# Altium project Motor_control.PrjPcb
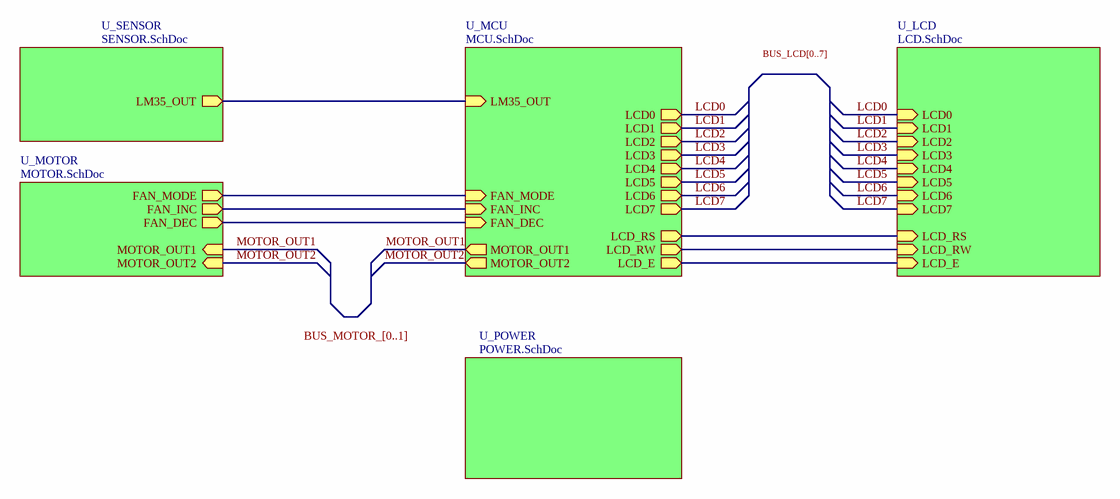
[diagram p0: MAIN.SchDoc]
6 sheets, 38 parts. Net scope: hierarchical (ports join the sheet entries above them; power ports are global).
Board file: PCB_Motor_controller.PcbDoc
Sheets:
  MAIN.SchDoc
    U_MCU = MCU.SchDoc
    U_LCD = LCD.SchDoc
    U_MOTOR = MOTOR.SchDoc
    U_POWER = POWER.SchDoc
    U_SENSOR = SENSOR.SchDoc

## Sheet MAIN.SchDoc
size A4; Author: Khoi Nghiem; Organization: Bach Khoa HN; Address1: Bach Khoa- HBT - HN; Address2: khoi.nt192941; Revision: 1.0Ver; SheetNumber: 1; SheetTotal: 6

### Sub-sheets
U_LCD = LCD.SchDoc: LCD0 (in), LCD1 (in), LCD2 (in), LCD3 (in), LCD4 (in), LCD5 (in), LCD6 (in), LCD7 (in), LCD_RS (in), LCD_RW (in), LCD_E (in)
U_MCU = MCU.SchDoc: LM35_OUT (in), MOTOR_OUT1 (out), MOTOR_OUT2 (out), FAN_MODE (in), FAN_INC (in), FAN_DEC (in), LCD0 (out), LCD1 (out), LCD2 (out), LCD3 (out), LCD4 (out), LCD5 (out), LCD6 (out), LCD7 (out), LCD_RS (out), LCD_RW (out), LCD_E (out)
U_MOTOR = MOTOR.SchDoc: MOTOR_OUT1 (in), MOTOR_OUT2 (in), FAN_MODE (out), FAN_INC (out), FAN_DEC (out)
U_POWER = POWER.SchDoc: no entries
U_SENSOR = SENSOR.SchDoc: LM35_OUT (out)

### Nets
FAN_DEC: sheet U_MCU/FAN_DEC, sheet U_MOTOR/FAN_DEC
FAN_INC: sheet U_MCU/FAN_INC, sheet U_MOTOR/FAN_INC
FAN_MODE: sheet U_MCU/FAN_MODE, sheet U_MOTOR/FAN_MODE
LCD0: sheet U_MCU/LCD0, sheet U_LCD/LCD0
LCD1: sheet U_MCU/LCD1, sheet U_LCD/LCD1
LCD2: sheet U_MCU/LCD2, sheet U_LCD/LCD2
LCD3: sheet U_MCU/LCD3, sheet U_LCD/LCD3
LCD4: sheet U_MCU/LCD4, sheet U_LCD/LCD4
LCD5: sheet U_MCU/LCD5, sheet U_LCD/LCD5
LCD6: sheet U_MCU/LCD6, sheet U_LCD/LCD6
LCD7: sheet U_MCU/LCD7, sheet U_LCD/LCD7
LCD_E: sheet U_MCU/LCD_E, sheet U_LCD/LCD_E
LCD_RS: sheet U_MCU/LCD_RS, sheet U_LCD/LCD_RS
LCD_RW: sheet U_MCU/LCD_RW, sheet U_LCD/LCD_RW
LM35_OUT: sheet U_MCU/LM35_OUT, sheet U_SENSOR/LM35_OUT
MOTOR_OUT1: sheet U_MCU/MOTOR_OUT1, sheet U_MOTOR/MOTOR_OUT1
MOTOR_OUT2: sheet U_MCU/MOTOR_OUT2, sheet U_MOTOR/MOTOR_OUT2

### Notes on the sheet
- BUS_LCD[0..7]
- BUS_MOTOR_[0..1]
- Title
- Size:
- Date:
- Author:
- A4
- Time:
- Number:
- Checked:
- Revision:
- Sheet
- Approved:
- of
- File:

## Sheet MCU.SchDoc
size A4; Author: Khanh BK; Organization: DB Bach Khoa HN; Address1: Bach Khoa- HBT - HN; Address2: khanh.db192932; Address3: Youtube: Đào Bá Khánh; Address4: 0357698570; Revision: 1.0Ver; SheetNumber: 2; SheetTotal: 6
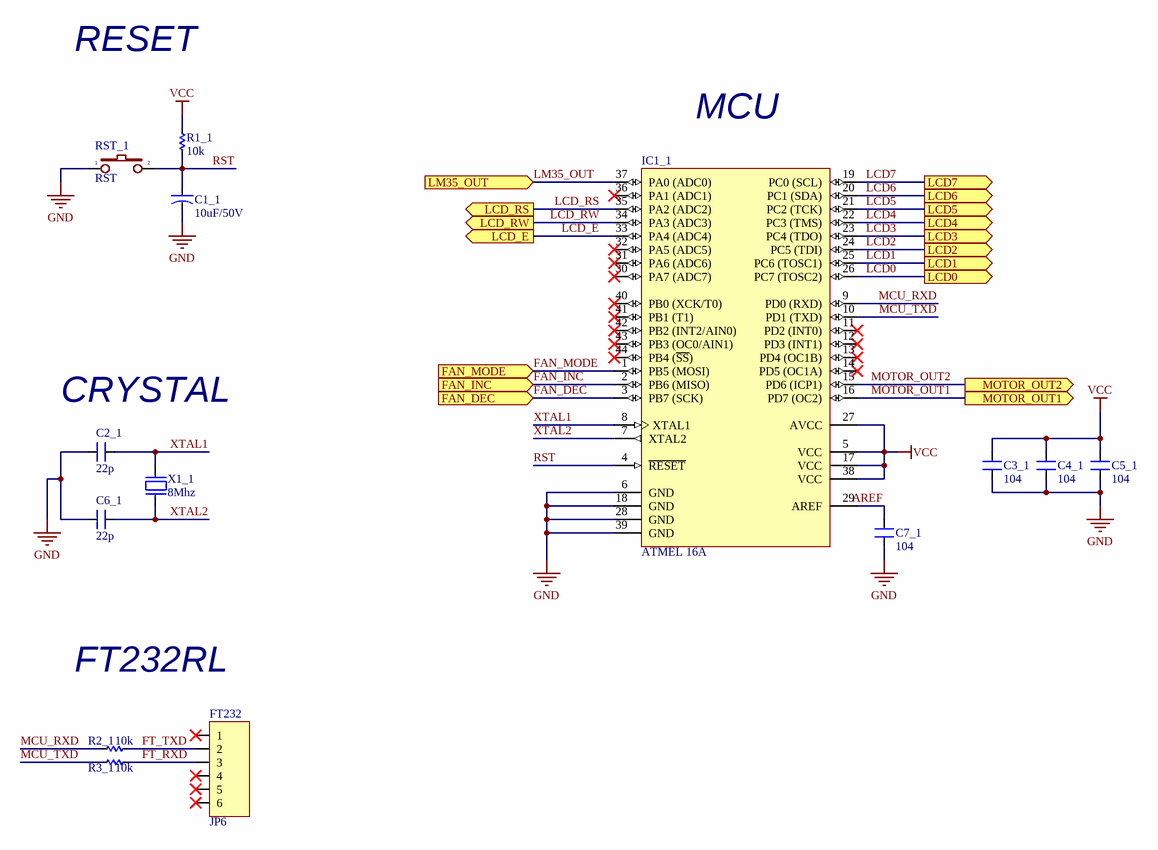
[diagram p1: MCU.SchDoc]

### Parts
C1_1  10uF/50V  [CAP-ALU-SMD-5.5x5.5]
C2_1  22p  [CN-SMD-0805]
C3_1  104  [CN-SMD-0805]
C4_1  104  [CN-SMD-0805]
C5_1  104  [CN-SMD-0805]
C6_1  22p  [CN-SMD-0805]
C7_1  104  [CN-SMD-0805]
FT232  JP6  [JP6-C1T]
IC1_1  ATMEL 16A  [TQFP44]
R1_1  10k  [RES-SMD-0805]
R2_1  10k  [RES-SMD-0805]
R3_1  10k  [RES-SMD-0805]
RST_1  RST  [SW1-SMD]
X1_1  8Mhz  [XT2]

### Ports
FAN_DEC (in), FAN_INC (in), FAN_MODE (in), LCD0 (out), LCD1 (out), LCD2 (out), LCD3 (out), LCD4 (out), LCD5 (out), LCD6 (out), LCD7 (out), LCD_E (out), LCD_RS (out), LCD_RW (out), LM35_OUT (in), MOTOR_OUT1 (out), MOTOR_OUT2 (out)

### Nets
GND: C1_1.2 C2_1.2 C3_1.1 C4_1.1 C5_1.1 C6_1.2 C7_1.1 IC1_1.6(GND) IC1_1.18(GND) IC1_1.28(GND) IC1_1.39(GND) RST_1.1
VCC: C3_1.2 C4_1.2 C5_1.2 IC1_1.5(VCC) IC1_1.17(VCC) IC1_1.27(AVCC) IC1_1.38(VCC) R1_1.1
AREF: C7_1.2 IC1_1.29(AREF)
FAN_DEC: IC1_1.3(PB7_(SCK)) ; port FAN_DEC
FAN_INC: IC1_1.2(PB6_(MISO)) ; port FAN_INC
FAN_MODE: IC1_1.1(PB5_(MOSI)) ; port FAN_MODE
FT_RXD: FT232.3 R3_1.1
FT_TXD: FT232.2 R2_1.1
LCD0: IC1_1.26(PC7_(TOSC2)) ; port LCD0
LCD1: IC1_1.25(PC6_(TOSC1)) ; port LCD1
LCD2: IC1_1.24(PC5_(TDI)) ; port LCD2
LCD3: IC1_1.23(PC4_(TDO)) ; port LCD3
LCD4: IC1_1.22(PC3_(TMS)) ; port LCD4
LCD5: IC1_1.21(PC2_(TCK)) ; port LCD5
LCD6: IC1_1.20(PC1_(SDA)) ; port LCD6
LCD7: IC1_1.19(PC0_(SCL)) ; port LCD7
LCD_E: IC1_1.33(PA4_(ADC4)) ; port LCD_E
LCD_RS: IC1_1.35(PA2_(ADC2)) ; port LCD_RS
LCD_RW: IC1_1.34(PA3_(ADC3)) ; port LCD_RW
LM35_OUT: IC1_1.37(PA0_(ADC0)) ; port LM35_OUT
MCU_RXD: IC1_1.9(PD0_(RXD)) R2_1.2
MCU_TXD: IC1_1.10(PD1_(TXD)) R3_1.2
MOTOR_OUT1: IC1_1.16(PD7_(OC2)) ; port MOTOR_OUT1
MOTOR_OUT2: IC1_1.15(PD6_(ICP1)) ; port MOTOR_OUT2
RST: C1_1.1 IC1_1.4(~{RESET}) R1_1.2 RST_1.2
XTAL1: C2_1.1 IC1_1.8(XTAL1) X1_1.2
XTAL2: C6_1.1 IC1_1.7(XTAL2) X1_1.1

Not connected (* = marked no-connect by the designer): FT232 1* 4* 5* 6*; IC1_1 11(PD2_(INT0))* 12(PD3_(INT1))* 13(PD4_(OC1B))* 14(PD5_(OC1A))* 30(PA7_(ADC7))* 31(PA6_(ADC6))* 32(PA5_(ADC5))* 36(PA1_(ADC1))* 40(PB0_(XCK/T0))* 41(PB1_(T1))* 42(PB2_(INT2/AIN0))* 43(PB3_(OC0/AIN1))* 44(PB4_(~{SS}))*

### Notes on the sheet
- RESET
- MCU
- (near C2_1) CRYSTAL
- FT232RL
- Title
- Size:
- Date:
- Author:
- A4
- Time:
- Number:
- Checked:
- Revision:
- Sheet
- Approved:
- of
- File:

### Library data of the parts
C1_1 = CN-ALU-SMD: Polarized Capacitor (Axial); Published: 8-Jun-2000; LatestRevisionDate: 17-Jul-2002; LatestRevisionNote: Re-released for DXP Platform.; PackageReference: POLAR0.8; Publisher: Altium Limited
C2_1 C3_1 C4_1 C5_1 C6_1 C7_1 = CN: Value: 33pF
FT232 = JP6: WR-PHD 2.54 mm Angled Socket Header; Manufacturer: W¨¹rth Elektronik eiSos GmbH; partNo: 613006143121; ComponentLink1 Description: Manufacturer; ComponentLink2 Description: Datasheet; NoPins: 06; Created Date: 29 March 2013; ComponentLink1URL: http://www.we-online.com; ComponentLink2URL: http://katalog.we-online.de/em/datasheet/6130xx143121.pdf; Created by: Karrer Zheng
IC1_1 = ATmega16A-AU: 8-bit AVR Microcontroller, 16KB Flash, 512 Bytes EEPROM, 1KB SRAM, 44-pin TQFP, Industrial Grade (-40°C to 85°C); Value: Atmega 16L
R1_1 R2_1 R3_1 = Res-SMD: Resistor; Manufacturer: Generic Components; Class: Passive; Published: 08/06/2000; Publisher: Altium Hobart Technology Centre
RST_1 = SW2: Switch button 2 pin; Value: SW chip 2 pin
X1_1 = XT2: Crystal, 32.768 KHz, -40 to 85 degC, 3.2 x 1.5 x 0.9 mm SMD; Value: 4Mhz

## Sheet LCD.SchDoc
size A4; Author: Khanh BK; Organization: DB Bach Khoa HN; Address1: Bach Khoa- HBT - HN; Address2: khanh.db192932; Address3: Youtube: Đào Bá Khánh; Address4: 0357698570; Revision: 1.0Ver; SheetNumber: 3; SheetTotal: 6
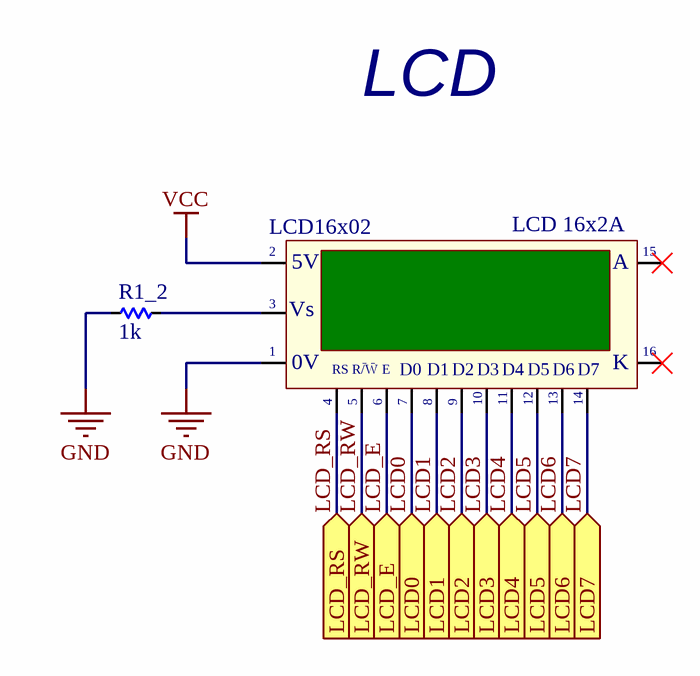
[diagram p2: LCD.SchDoc]

### Parts
LCD16x02  LCD 16x2A  [LCD16X2]
R1_2  1k  [RES-SMD-0805]

### Ports
LCD0 (in), LCD1 (in), LCD2 (in), LCD3 (in), LCD4 (in), LCD5 (in), LCD6 (in), LCD7 (in), LCD_E (in), LCD_RS (in), LCD_RW (in)

### Nets
GND: LCD16x02.1(GND) R1_2.2
VCC: LCD16x02.2(VDD)
LCD0: LCD16x02.7(D0) ; port LCD0
LCD1: LCD16x02.8(D1) ; port LCD1
LCD2: LCD16x02.9(D2) ; port LCD2
LCD3: LCD16x02.10(D3) ; port LCD3
LCD4: LCD16x02.11(D4) ; port LCD4
LCD5: LCD16x02.12(D5) ; port LCD5
LCD6: LCD16x02.13(D6) ; port LCD6
LCD7: LCD16x02.14(D7) ; port LCD7
LCD_E: LCD16x02.6(~{EN}) ; port LCD_E
LCD_RS: LCD16x02.4(RS) ; port LCD_RS
LCD_RW: LCD16x02.5(R/~{W}) ; port LCD_RW
NetLCD16x02_3: LCD16x02.3(VEE) R1_2.1

Not connected (* = marked no-connect by the designer): LCD16x02 15(A)* 16(K)*

### Notes on the sheet
- LCD
- Title
- Size:
- Date:
- Author:
- A4
- Time:
- Number:
- Checked:
- Revision:
- Sheet
- Approved:
- of
- File:
- (in symbol LCD16x2A) 5V; Vs; |; 0V; R/W; E

### Library data of the parts
LCD16x02 = LCD16x2A: LCD dipslay 16 char, 2 line; Value: LCD16x2A
R1_2 = Res-SMD: as R1_1 on sheet MCU; Published: 08/06/2000; Publisher: Altium Hobart Technology Centre

## Sheet MOTOR.SchDoc
size A4; Author: Khanh BK; Organization: DB Bach Khoa HN; Address1: Bach Khoa- HBT - HN; Address2: khanh.db192932; Address3: Youtube: Đào Bá Khánh; Address4: 0357698570; Revision: 1.0Ver; SheetNumber: 4; SheetTotal: 6
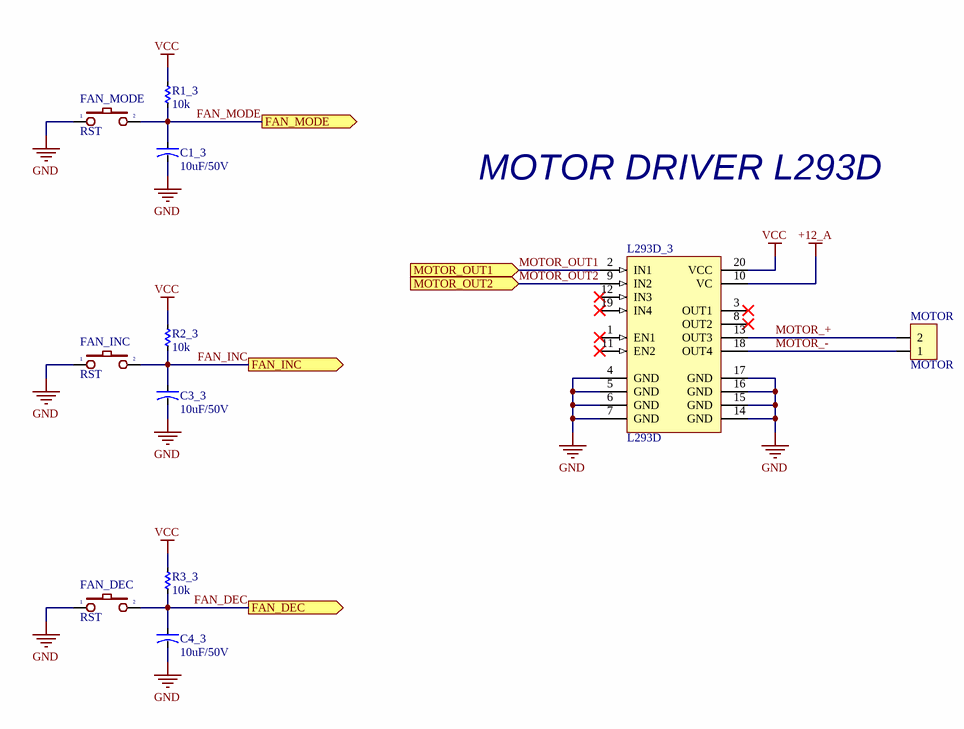
[diagram p3: MOTOR.SchDoc]

### Parts
C1_3  10uF/50V  [CAP-ALU-SMD-5.5x5.5]
C3_3  10uF/50V  [CAP-ALU-SMD-5.5x5.5]
C4_3  10uF/50V  [CAP-ALU-SMD-5.5x5.5]
FAN_DEC  RST  [SW1-SMD]
FAN_INC  RST  [SW1-SMD]
FAN_MODE  RST  [SW1-SMD]
L293D_3  L293D  [SO20]
MOTOR  MOTOR  [Header2]
R1_3  10k  [RES-SMD-0805]
R2_3  10k  [RES-SMD-0805]
R3_3  10k  [RES-SMD-0805]

### Ports
FAN_DEC (out), FAN_INC (out), FAN_MODE (out), MOTOR_OUT1 (in), MOTOR_OUT2 (in)

### Nets
+12_A: L293D_3.10(VC)
GND: C1_3.2 C3_3.2 C4_3.2 FAN_DEC.1 FAN_INC.1 FAN_MODE.1 L293D_3.4(GND) L293D_3.5(GND) L293D_3.6(GND) L293D_3.7(GND) L293D_3.14(GND) L293D_3.15(GND) L293D_3.16(GND) L293D_3.17(GND)
VCC: L293D_3.20(VCC) R1_3.1 R2_3.1 R3_3.1
FAN_DEC: C4_3.1 FAN_DEC.2 R3_3.2 ; port FAN_DEC
FAN_INC: C3_3.1 FAN_INC.2 R2_3.2 ; port FAN_INC
FAN_MODE: C1_3.1 FAN_MODE.2 R1_3.2 ; port FAN_MODE
MOTOR_+: L293D_3.13(OUT3) MOTOR.2
MOTOR_-: L293D_3.18(OUT4) MOTOR.1
MOTOR_OUT1: L293D_3.2(IN1) ; port MOTOR_OUT1
MOTOR_OUT2: L293D_3.9(IN2) ; port MOTOR_OUT2

Not connected (* = marked no-connect by the designer): L293D_3 1(EN1)* 3(OUT1)* 8(OUT2)* 11(EN2)* 12(IN3)* 19(IN4)*

### Notes on the sheet
- MOTOR DRIVER L293D
- Title
- Size:
- Date:
- Author:
- A4
- Time:
- Number:
- Checked:
- Revision:
- Sheet
- Approved:
- of
- File:

### Library data of the parts
C1_3 C3_3 C4_3 = CN-ALU-SMD: Polarized Capacitor (Axial); Published: 8-Jun-2000; LatestRevisionDate: 17-Jul-2002; LatestRevisionNote: Re-released for DXP Platform.; PackageReference: POLAR0.8; Publisher: Altium Limited
FAN_DEC FAN_INC FAN_MODE = SW2: as RST_1 on sheet MCU
L293D_3 = L293D_SMD: Push-Pull Four Channel Driver With Diode; Published: 8-Jun-2000; LatestRevisionDate: 06-Jun-2005; LatestRevisionNote: Stylized 3D Model Added.; DatasheetVersion: Jun-1996; PackageVersion: Apr-1996; PackageReference: DIP16; Publisher: Altium Limited; PackageDescription: DIP; 16 Leads; Row Spacing 7.62 mm; Pitch 2.54 mm; ComponentLink1Description: Manufacturer Link; ComponentLink1URL: http://www.st.com/; ComponentLink2Description: Datasheet; ComponentLink2URL: http://www.st.com/stonline/products/literature/ds/1330/l293d.pdf
MOTOR = Header2: Header IDC, 2 x 1 Pin Vertical 2.54mm Pitch (Non-Boxed, Male); Manufacturer: W¨¹rth Elektronik eiSos GmbH; partNo: 613002143121; ComponentLink1 Description: Manufacturer; ComponentLink2 Description: Datasheet; NoPins: 02; Created Date: 29 March 2013; ComponentLink1URL: http://www.we-online.com; ComponentLink2URL: http://katalog.we-online.de/em/datasheet/6130xx143121.pdf; Created by: Karrer Zheng
R1_3 R2_3 R3_3 = Res-SMD: as R1_1 on sheet MCU; Published: 08/06/2000; Publisher: Altium Hobart Technology Centre

## Sheet POWER.SchDoc
size A4; Author: Khanh BK; Organization: DB Bach Khoa HN; Address1: Bach Khoa- HBT - HN; Address2: khanh.db192932; Address3: Youtube: Đào Bá Khánh; Address4: 0357698570; Revision: 1.0Ver; SheetNumber: 5; SheetTotal: 6
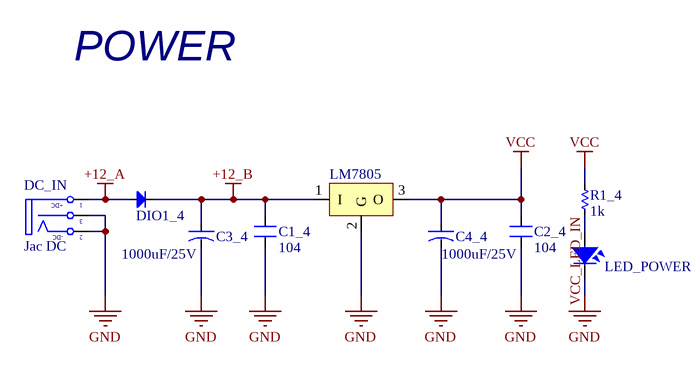
[diagram p4: POWER.SchDoc]

### Parts
C1_4  104  [CN-SMD-0805]
C2_4  104  [CN-SMD-0805]
C3_4  1000uF/25V  [CAP-ALU-SMD-4.5x5x1.4]
C4_4  1000uF/25V  [CAP-ALU-SMD-4.5x5x1.4]
DC_IN  Jac DC  [DC0]
DIO1_4  Diode SMD  [DIO-SMD-106]  (value not drawn)
LED_POWER  LED  [LED-RED-0805]  (value not drawn)
LM7805  LM78xx  [TO252-123]  (value not drawn)
R1_4  1k  [RES-SMD-0805]

### Nets
+12_A: DC_IN.1(T) DIO1_4.1(A)
+12_B: C1_4.2 C3_4.1 DIO1_4.2(K) LM7805.1(I)
GND: C1_4.1 C2_4.1 C3_4.2 C4_4.2 DC_IN.2(TN) DC_IN.3(S) LED_POWER.2 LM7805.2(G)
VCC: C2_4.2 C4_4.1 LM7805.3(O) R1_4.1
VCC_LED_IN: LED_POWER.1 R1_4.2

### Notes on the sheet
- POWER
- Title
- Size:
- Date:
- Author:
- A4
- Time:
- Number:
- Checked:
- Revision:
- Sheet
- Approved:
- of
- File:
- (in symbol DCIN) +DC; -DC

### Library data of the parts
C1_4 C2_4 = CN: Value: 33pF
C3_4 C4_4 = CN-ALU-SMD: Polarized Capacitor (Axial); Published: 8-Jun-2000; LatestRevisionDate: 17-Jul-2002; LatestRevisionNote: Re-released for DXP Platform.; PackageReference: POLAR0.8; Publisher: Altium Limited
DC_IN = DCIN: Jac DC input; Value: Jac DC
DIO1_4 = Diode SMD: Default Diode; Code - JEDEC: DO-214-AB; Value: 1N5007; Published: 8-Jun-2000; Revision: July-2002: Re-released for DXP Platform.; Publisher: Altium Limited
LED_POWER = LED SMD: Value: LED 3 - 5 ly 2 Colour
LM7805 = LM78xx: Positive Voltage Regulator; Note: Tab is connected to pin 3 (GND).; Published: 24-Aug-2001; LatestRevisionDate: 17-Jul-2002; LatestRevisionNote: Re-released for DXP Platform.; DatasheetVersion: Apr-1994; PackageVersion: Jul-1998; PackageReference: ISOWATT220AB; Publisher: Altium Limited; PackageDescription: TO, Thru-Hole, Vertical, Heatsink Mounted; 3 In-Line Leads; Pitch 2.54 mm; Pin sequence 1, 3, 2; ComponentLink1Description: Manufacturer Link; ComponentLink1URL: http://www.st.com/; ComponentLink2Description: Datasheet; ComponentLink2URL: http://www.st.com/stonline/products/literature/ds/2146/l78m05c.pdf
R1_4 = Res-SMD: as R1_1 on sheet MCU; Published: 08/06/2000; Publisher: Altium Hobart Technology Centre

## Sheet SENSOR.SchDoc
size A4; Author: Khanh BK; Organization: DB Bach Khoa HN; Address1: Bach Khoa- HBT - HN; Address2: khanh.db192932; Address3: Youtube: Đào Bá Khánh; Address4: 0357698570; Revision: 1.0Ver; SheetNumber: 6; SheetTotal: 6
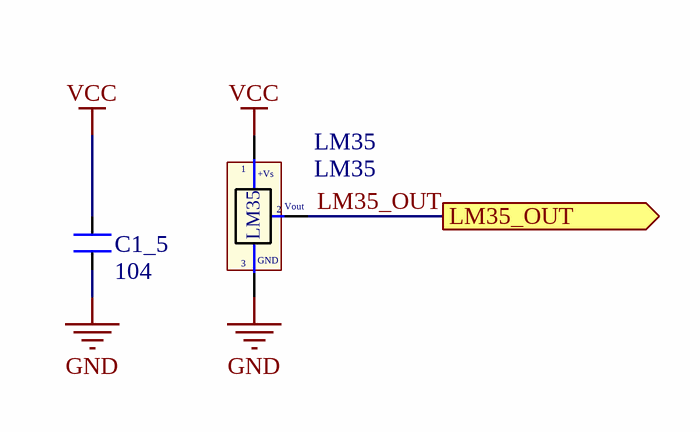
[diagram p5: SENSOR.SchDoc]

### Parts
C1_5  104  [CN-SMD-0805]
LM35  LM35  [TO92-123]

### Ports
LM35_OUT (out)

### Nets
GND: C1_5.1 LM35.3(-)
VCC: C1_5.2 LM35.1(+Vs)
LM35_OUT: LM35.2(Vout) ; port LM35_OUT

### Notes on the sheet
- Title
- Size:
- Date:
- Author:
- A4
- Time:
- Number:
- Checked:
- Revision:
- Sheet
- Approved:
- of
- File:
- (in symbol LM35) GND

### Library data of the parts
C1_5 = CN: Value: 33pF
LM35 = LM35: Teminal; Value: LM35

## Nets that join several sheets
+12_A: MOTOR (L293D_3.10), POWER (DC_IN.1 DIO1_4.1)
GND: MCU (12 pins), LCD (LCD16x02.1 R1_2.2), MOTOR (14 pins), POWER (8 pins), SENSOR (C1_5.1 LM35.3)
VCC: MCU (8 pins), LCD (LCD16x02.2), MOTOR (L293D_3.20 R1_3.1 R2_3.1 R3_3.1), POWER (C2_4.2 C4_4.1 LM7805.3 R1_4.1), SENSOR (C1_5.2 LM35.1)
FAN_DEC: MCU (IC1_1.3), MOTOR (C4_3.1 FAN_DEC.2 R3_3.2)
FAN_INC: MCU (IC1_1.2), MOTOR (C3_3.1 FAN_INC.2 R2_3.2)
FAN_MODE: MCU (IC1_1.1), MOTOR (C1_3.1 FAN_MODE.2 R1_3.2)
LCD0: MCU (IC1_1.26), LCD (LCD16x02.7)
LCD1: MCU (IC1_1.25), LCD (LCD16x02.8)
LCD2: MCU (IC1_1.24), LCD (LCD16x02.9)
LCD3: MCU (IC1_1.23), LCD (LCD16x02.10)
LCD4: MCU (IC1_1.22), LCD (LCD16x02.11)
LCD5: MCU (IC1_1.21), LCD (LCD16x02.12)
LCD6: MCU (IC1_1.20), LCD (LCD16x02.13)
LCD7: MCU (IC1_1.19), LCD (LCD16x02.14)
LCD_E: MCU (IC1_1.33), LCD (LCD16x02.6)
LCD_RS: MCU (IC1_1.35), LCD (LCD16x02.4)
LCD_RW: MCU (IC1_1.34), LCD (LCD16x02.5)
LM35_OUT: MCU (IC1_1.37), SENSOR (LM35.2)
MOTOR_OUT1: MCU (IC1_1.16), MOTOR (L293D_3.2)
MOTOR_OUT2: MCU (IC1_1.15), MOTOR (L293D_3.9)